# Altium project SurfaceControlSystem_RevA.PrjPcb
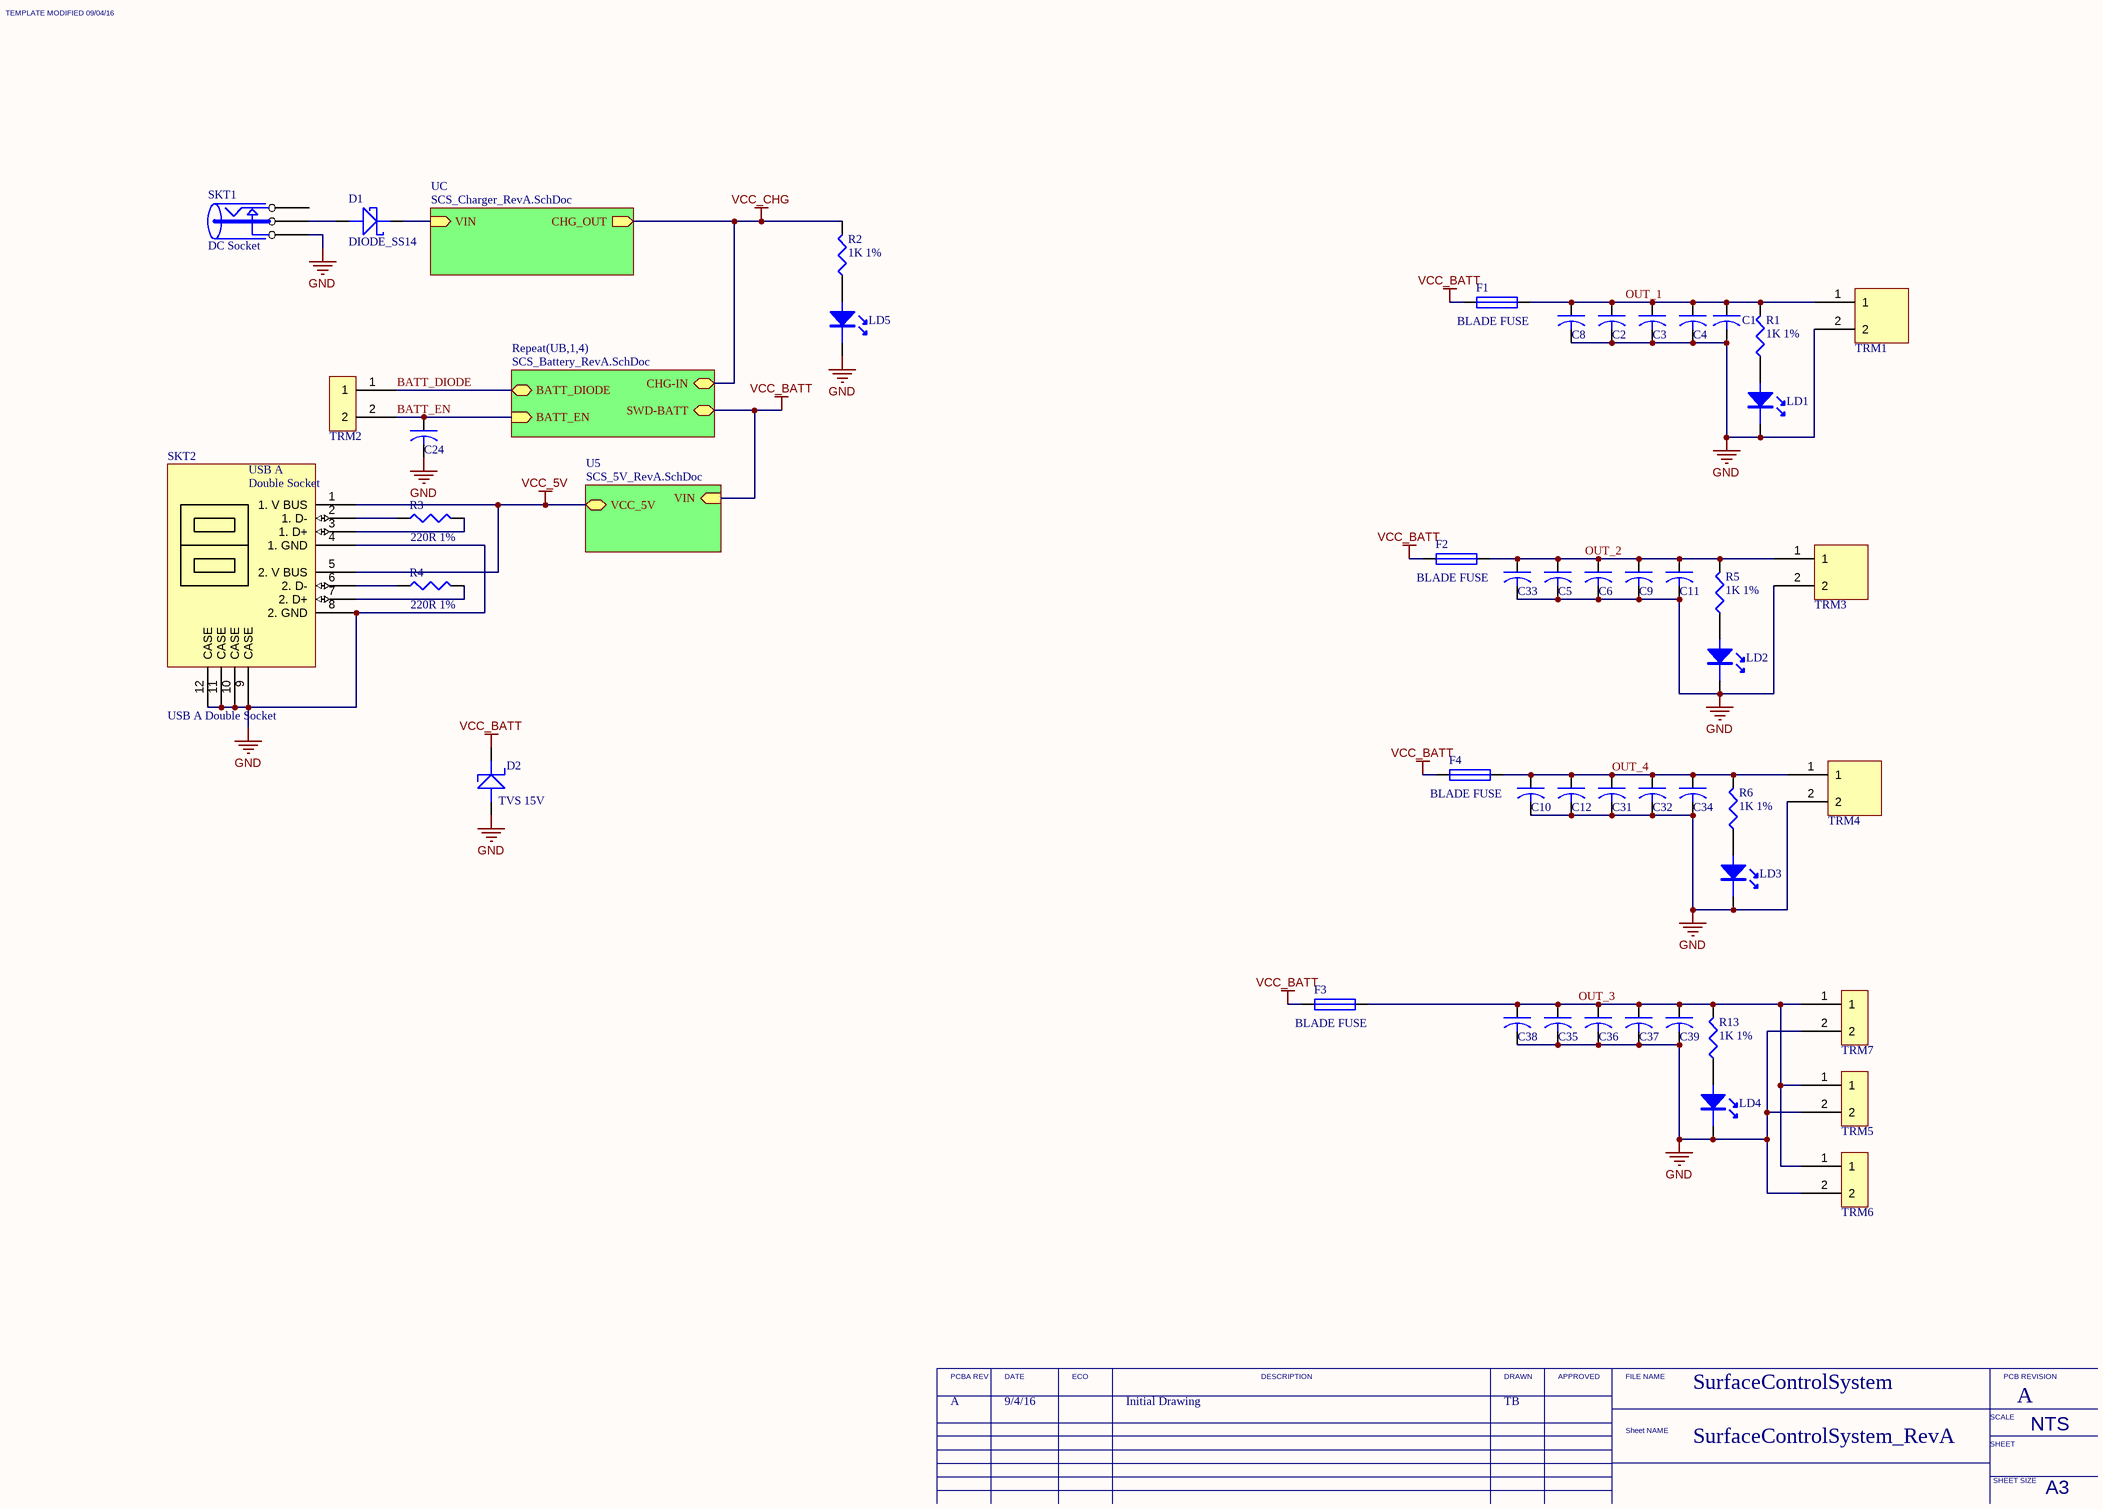
[diagram p0: SurfaceControlSystem_RevA.SchDoc]
4 sheets, 136 parts. Net scope: hierarchical (ports join the sheet entries above them; power ports are global).
Board file: SurfaceControlSystem.PcbDoc
Sheets:
  SurfaceControlSystem_RevA.SchDoc
    UB1 = SCS_Battery_RevA.SchDoc
    UB2 = SCS_Battery_RevA.SchDoc
    UB3 = SCS_Battery_RevA.SchDoc
    UB4 = SCS_Battery_RevA.SchDoc
    U5 = SCS_5V_RevA.SchDoc
    UC = SCS_Charger_RevA.SchDoc

## Sheet SurfaceControlSystem_RevA.SchDoc
size A3; _PRJ_TITLE: PROJECT TITLE; _SHT_TITLE: Sheet; _REV: A; PageSetup: Record=PageOptions|CenterHorizontal=True|CenterVertical=True|PrintScale=0.71|XCorrection=1.00|YCorrection=1.00|PrintKind=0|BorderSize=5000000|LeftOffset=0|BottomOffset=0|Orientation=2|PaperLength=1000|PaperWidth=1000|Scale=100|PaperSource=258|PrintQuality=600|MediaType=1|DitherType=10|PaperKind=A3 (297x420mm)|PrintScaleMode=1

### Parts
C1  10UF 25V  [1206]  (value not drawn)
C2  10UF 25V  [1206]  (value not drawn)
C3  10UF 25V  [1206]  (value not drawn)
C4  10UF 25V  [1206]  (value not drawn)
C5  10UF 25V  [1206]  (value not drawn)
C6  10UF 25V  [1206]  (value not drawn)
C8  100nF 50V  [0603]  (value not drawn)
C9  10UF 25V  [1206]  (value not drawn)
C10  100nF 50V  [0603]  (value not drawn)
C11  10UF 25V  [1206]  (value not drawn)
C12  10UF 25V  [1206]  (value not drawn)
C24  100nF 50V  [0603]  (value not drawn)
C31  10UF 25V  [1206]  (value not drawn)
C32  10UF 25V  [1206]  (value not drawn)
C33  100nF 50V  [0603]  (value not drawn)
C34  10UF 25V  [1206]  (value not drawn)
C35  10UF 25V  [1206]  (value not drawn)
C36  10UF 25V  [1206]  (value not drawn)
C37  10UF 25V  [1206]  (value not drawn)
C38  100nF 50V  [0603]  (value not drawn)
C39  10UF 25V  [1206]  (value not drawn)
D1  DIODE_SS14  [DO-214AC]
D2  TVS 15V  [DO-214AB]
F1  BLADE FUSE  [FUSEHOLDER_BLADE]
F2  BLADE FUSE  [FUSEHOLDER_BLADE]
F3  BLADE FUSE  [FUSEHOLDER_BLADE]
F4  BLADE FUSE  [FUSEHOLDER_BLADE]
LD1  Green LED 0805  [0805DIODE]  (value not drawn)
LD2  Green LED 0805  [0805DIODE]  (value not drawn)
LD3  Green LED 0805  [0805DIODE]  (value not drawn)
LD4  Green LED 0805  [0805DIODE]  (value not drawn)
LD5  Green LED 0805  [0805DIODE]  (value not drawn)
R1  1K 1%  [0603]
R2  1K 1%  [0603]
R3  220R 1%  [0603]
R4  220R 1%  [0603]
R5  1K 1%  [0603]
R6  1K 1%  [0603]
R13  1K 1%  [0603]
SKT1  DC Socket  [SKT_PWR]
SKT2  USB A Double Socket  [USB_A_DoubleSocket]
TRM1  2way screw terminal, High current  [TERM_2POS_HORIZ_7.62MM]  (value not drawn)
TRM2  Wurth 2way screw terminal  [TERM_2POS_HORIZ_5.08MM]  (value not drawn)
TRM3  2way screw terminal, High current  [TERM_2POS_HORIZ_7.62MM]  (value not drawn)
TRM4  2way screw terminal, High current  [TERM_2POS_HORIZ_7.62MM]  (value not drawn)
TRM5  Wurth 2way screw terminal  [TERM_2POS_HORIZ_5.08MM]  (value not drawn)
TRM6  Wurth 2way screw terminal  [TERM_2POS_HORIZ_5.08MM]  (value not drawn)
TRM7  Wurth 2way screw terminal  [TERM_2POS_HORIZ_5.08MM]  (value not drawn)

### Sub-sheets
Repeat(UB,1,4) = SCS_Battery_RevA.SchDoc: SWD-BATT (bidir), CHG-IN (bidir), BATT_EN (in), BATT_DIODE (bidir)
U5 = SCS_5V_RevA.SchDoc: VIN (in), VCC_5V (bidir)
UC = SCS_Charger_RevA.SchDoc: VIN (in), CHG_OUT (out)

### Nets
GND: C1.2 C2.2 C3.2 C4.2 C5.2 C6.2 C8.2 C9.2 C10.2 C11.2 C12.2 C24.2 C31.2 C32.2 C33.2 C34.2 C35.2 C36.2 C37.2 C38.2 C39.2 D2.A LD1.K LD2.K LD3.K LD4.K LD5.K SKT1.SW SKT2.4(1._GND) SKT2.8(2._GND) SKT2.9(CASE) SKT2.10(CASE) SKT2.11(CASE) SKT2.12(CASE) TRM1.2 TRM3.2 TRM4.2 TRM5.2 TRM6.2 TRM7.2
VCC_5V: SKT2.1(1._V_BUS) SKT2.5(2._V_BUS) ; sheet U5/VCC_5V  [project net 5v]
VCC_BATT: D2.K F1.1 F2.1 F3.1 F4.1 ; sheet Repeat(UB,1,4)/SWD-BATT, sheet U5/VIN
VCC_CHG: R2.2 ; sheet Repeat(UB,1,4)/CHG-IN, sheet UC/CHG_OUT
BATT_DIODE: TRM2.1 ; sheet Repeat(UB,1,4)/BATT_DIODE
BATT_EN: C24.1 TRM2.2 ; sheet Repeat(UB,1,4)/BATT_EN
Chg_In: D1.K ; sheet UC/VIN
OUT_1: C1.1 C2.1 C3.1 C4.1 C8.1 F1.2 R1.2 TRM1.1
OUT_2: C5.1 C6.1 C9.1 C11.1 C33.1 F2.2 R5.2 TRM3.1
OUT_3: C35.1 C36.1 C37.1 C38.1 C39.1 F3.2 R13.2 TRM5.1 TRM6.1 TRM7.1
OUT_4: C10.1 C12.1 C31.1 C32.1 C34.1 F4.2 R6.2 TRM4.1
NetD1_A: D1.A SKT1.PIN
NetLD1_A: LD1.A R1.1
NetLD2_A: LD2.A R5.1
NetLD3_A: LD3.A R6.1
NetLD4_A: LD4.A R13.1
NetLD5_A: LD5.A R2.1
NetR3_1: R3.1 SKT2.3(1._D+)
NetR3_2: R3.2 SKT2.2(1._D-)
NetR4_1: R4.1 SKT2.7(2._D+)
NetR4_2: R4.2 SKT2.6(2._D-)

Not connected (* = marked no-connect by the designer): SKT1 COM

### Notes on the sheet
- SurfaceControlSystem
- A
- 9/4/16
- Initial Drawing
- TB
- SurfaceControlSystem_RevA
- TEMPLATE MODIFIED 09/04/16
- PCBA REV
- DATE
- ECO
- DESCRIPTION
- DRAWN
- APPROVED
- FILE NAME
- PCB REVISION
- Sheet NAME
- SCALE
- SHEET
- NTS
- SHEET SIZE
- A3
- (in symbol USB_A_Double) USB A; Double Socket

### Library data of the parts
C1-C6 C9 C11 C12 C31 C32 C34-C37 C39 = CAP_10UF_25V_10%_1206: CAP CER 10UF 25V 10% X5R 1206; Manufacturer: Murata; Manufacturer P/N: GRM319R61E106KA12D
C8 C10 C24 C33 C38 = CAP_100NF_50V_10%_0603: CAP CER 100nF 50V 10% X7R 0603; Manufacturer: Murata; Manufacturer P/N: GRM188R71H104KA93D
D1 = DIODE_SS14: Schottky Diode, 1A, 40V SS14; Manufacturer: Fairchild; Manufacturer P/N: SS14
D2 = DIODE_TVS_SMCJ15A: TVS Diode, 15V; Manufacturer: LIttlefuse; Manufacturer P/N: SMCJ15A
F1-F4 = FUSE_BLADE_500V_30A_PCB: FUSE CLIP BLADE 500V 30A PCB; Manufacturer: Keystone Electronics; Manufacturer P/N: 3522-2
LD1-LD5 = LED_Green_0805: WL-SMCW SMD CHIP LED WATERCLEAR; Manufacturer: Wurth; Manufacturer P/N: 150080VS75000
R1 R2 R5 R6 R13 = RES_1K_1%_0603: Resistor, 1K, 1%, 0603; Manufacturer: Bourns Inc; Manufacturer P/N: CR0603-FX-1001ELF
R3 R4 = RES_220R_1%_0603: Resistor, 220R, 1%, 0603; Manufacturer: Bourns Inc; Manufacturer P/N: CR0603-FX-2200ELF
SKT1 = SOCKET_DC: Manufacturer: N/A; Manufacturer P/N: N/A
SKT2 = USB_A_Double: PartNo: P1301; Supplier: Altronics
TRM1 TRM3 TRM4 = TRM_2way_ScrewTerminal_7.62mm: TERM BLOCK 2POS HORIZ 7.62MM T/H; Manufacturer: Altronics; Manufacturer P/N: P4343
TRM2 TRM5-TRM7 = TRM_2way_ScrewTerminal: TERM BLOCK 2POS HORIZ 5.08MM T/H; Manufacturer: Wurth Electronics Inc; Manufacturer P/N: 691216510002

## Sheet SCS_Battery_RevA.SchDoc
size A3; _PRJ_TITLE: PROJECT TITLE; _SHT_TITLE: Sheet; _REV: A; PageSetup: Record=PageOptions|CenterHorizontal=True|CenterVertical=True|PrintScale=0.71|XCorrection=1.00|YCorrection=1.00|PrintKind=0|BorderSize=5000000|LeftOffset=0|BottomOffset=0|Orientation=2|PaperLength=1000|PaperWidth=1000|Scale=100|PaperSource=258|PrintQuality=600|MediaType=1|DitherType=10|PaperKind=A3 (297x420mm)|PrintScaleMode=1
Used 4 times, as channels UB1, UB2, UB3, UB4. Parts and nets are listed once, with the designators drawn on the sheet.
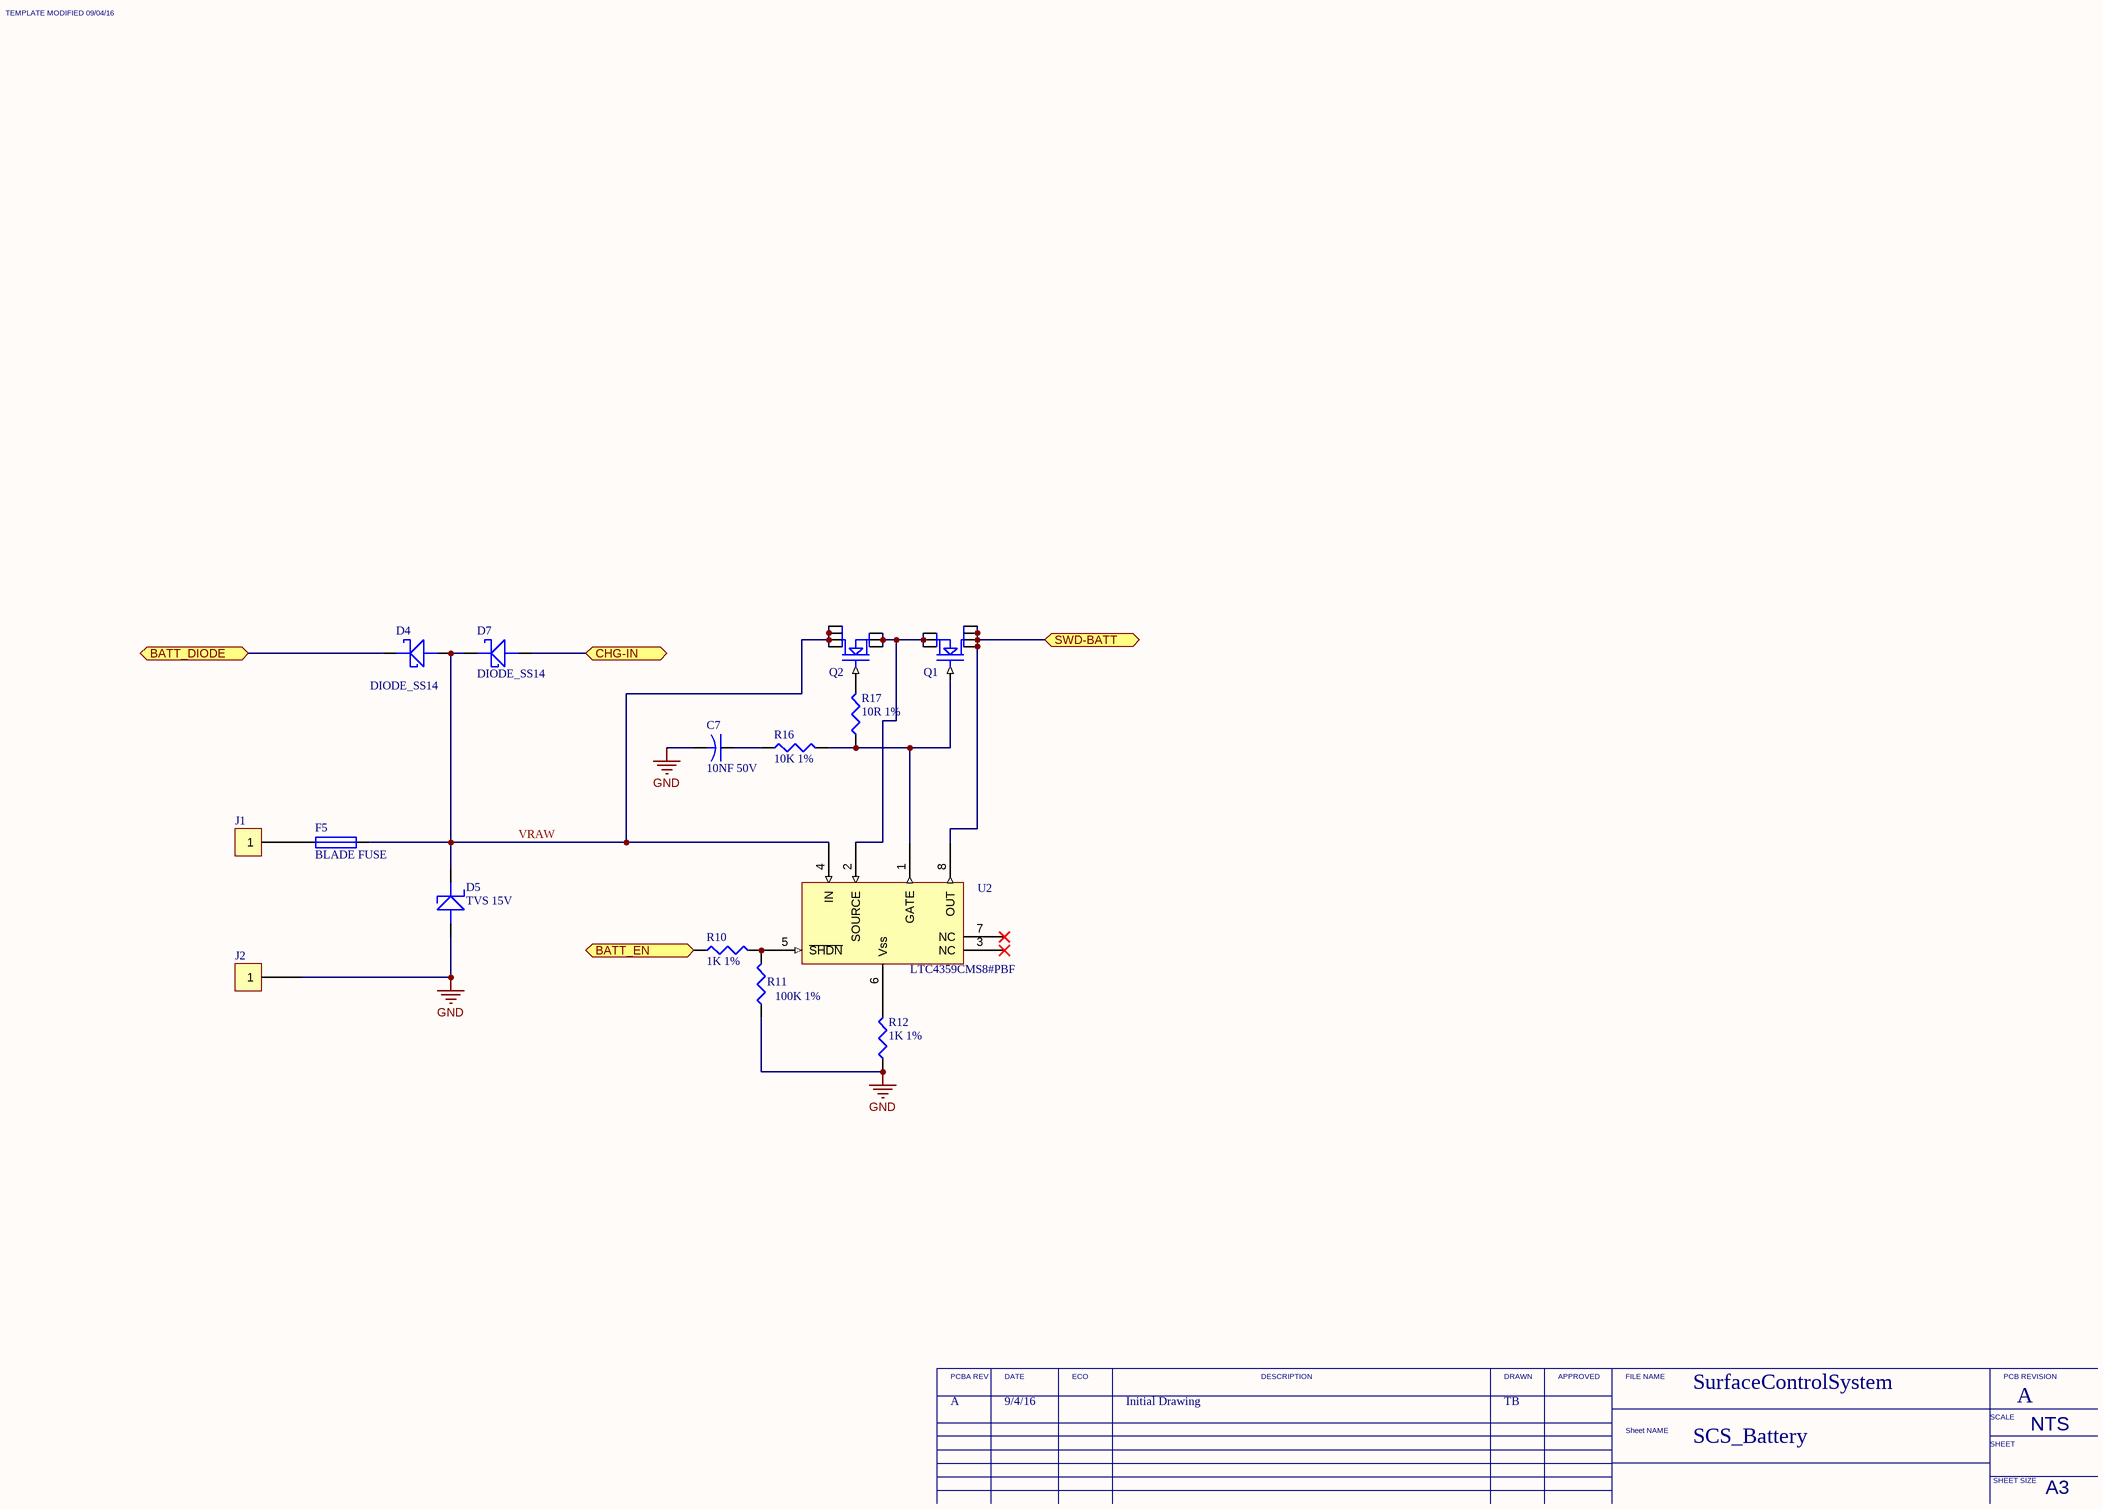
[diagram p1: SCS_Battery_RevA.SchDoc]

### Parts
C7  10NF 50V  [0603]
D4  DIODE_SS14  [DO-214AC]
D5  TVS 15V  [DO-214AB]
D7  DIODE_SS14  [DO-214AC]
F5  BLADE FUSE  [FUSEHOLDER_BLADE]
J1  5mm Pitch 6.3mm SPADE  [CON_5mm_6.3MM_SPADE]  (value not drawn)
J2  5mm Pitch 6.3mm SPADE  [CON_5mm_6.3MM_SPADE]  (value not drawn)
Q1  N Channel FET  [SO-8]  (value not drawn)
Q2  N Channel FET  [SO-8]  (value not drawn)
R10  1K 1%  [0603]
R11  100K 1%  [0603]
R12  1K 1%  [0603]
R16  10K 1%  [0603]
R17  10R 1%  [0603]
U2  LTC4359CMS8#PBF  [TSOP65P490X110-8M]

### Ports
BATT_DIODE (bidir), BATT_EN (in), CHG-IN (bidir), SWD-BATT (bidir)

### Nets
GND: C7.2 D5.A J2.1 R11.1 R12.1
BATT_DIODE: D4.K ; port BATT_DIODE
BATT_EN: R10.1 ; port BATT_EN
CHG-IN: D7.A ; port CHG-IN
SWD-BATT: Q1.5(DRAIN) Q1.6(DRAIN) Q1.7(DRAIN) Q1.8(DRAIN) U2.8(OUT) ; port SWD-BATT
VRAW: D4.A D5.K D7.K F5.2 Q2.5(DRAIN) Q2.6(DRAIN) Q2.7(DRAIN) Q2.8(DRAIN) U2.4(IN)
NetC7_1: C7.1 R16.1
NetF5_1: F5.1 J1.1
NetQ1_1: Q1.1(SOURCE) Q1.2(SOURCE) Q1.3(SOURCE) Q2.1(SOURCE) Q2.2(SOURCE) Q2.3(SOURCE) U2.2(SOURCE)
NetQ1_4: Q1.4(GATE) R16.2 R17.1 U2.1(GATE)
NetQ2_4: Q2.4(GATE) R17.2
NetR10_2: R10.2 R11.2 U2.5(~{SHDN})
NetR12_2: R12.2 U2.6(Vss)

Not connected (* = marked no-connect by the designer): U2 3(NC)* 7(NC)*

### Channels
UB1: designators end in _UB1; ports BATT_DIODE=BATT_DIODE BATT_EN=BATT_EN CHG-IN=VCC_CHG SWD-BATT=VCC_BATT
UB2: designators end in _UB2; ports BATT_DIODE=BATT_DIODE BATT_EN=BATT_EN CHG-IN=VCC_CHG SWD-BATT=VCC_BATT
UB3: designators end in _UB3; ports BATT_DIODE=BATT_DIODE BATT_EN=BATT_EN CHG-IN=VCC_CHG SWD-BATT=VCC_BATT
UB4: designators end in _UB4; ports BATT_DIODE=BATT_DIODE BATT_EN=BATT_EN CHG-IN=VCC_CHG SWD-BATT=VCC_BATT

### Notes on the sheet
- SurfaceControlSystem
- A
- 9/4/16
- Initial Drawing
- TB
- SCS_Battery
- TEMPLATE MODIFIED 09/04/16
- PCBA REV
- DATE
- ECO
- DESCRIPTION
- DRAWN
- APPROVED
- FILE NAME
- PCB REVISION
- Sheet NAME
- SCALE
- SHEET
- NTS
- SHEET SIZE
- A3

### Library data of the parts
C7 = CAP_10NF_50V_10%_0603: CAP CER 10NF 50V 10% X7R 0603; Manufacturer: Murata; Manufacturer P/N: GRM188R71H103KA01D
D4 D7 = DIODE_SS14: as D1 on sheet SurfaceControlSystem_RevA; Manufacturer P/N: SS14
D5 = DIODE_TVS_SMCJ15A: TVS Diode, 15V; Manufacturer: LIttlefuse; Manufacturer P/N: SMCJ15A
F5 = FUSE_BLADE_500V_30A_PCB: as F1 on sheet SurfaceControlSystem_RevA
J1 J2 = CON_5mm_6.3MM_SPADE: Manufacturer: Dinkle; Manufacturer P/N: P-850
Q1 Q2 = Q_AO4578: MOSFET N-CH 30V 20A LFPAK; Manufacturer: Alpha & Omega Semiconductor Inc.; Manufacturer P/N: AO4578
R10 R12 = RES_1K_1%_0603: as R1 on sheet SurfaceControlSystem_RevA
R11 = RES_100K_1%_0603: Resistor, 100K, 1%, 0603; Manufacturer: Bourns Inc; Manufacturer P/N: CRT0603-BY-1003ELF
R16 = RES_10K_1%_0603: Resistor, 10K, 1%, 0603; Manufacturer: Bourns Inc; Manufacturer P/N: CR0603-FX-1002HLF
R17 = RES_10R_1%_0603: Resistor, 10R, 1%, 0603; Manufacturer: Bourns Inc; Manufacturer P/N: CR0603-FX-10R0ELF
U2 = IC_LTC4359: Ideal Diode Controller; Manufacturer: Linear Technology; Manufacturer P/N: LTC4359CMS8#PBF

## Sheet SCS_5V_RevA.SchDoc
size A3; _PRJ_TITLE: PROJECT TITLE; _SHT_TITLE: Sheet; _REV: A; PageSetup: Record=PageOptions|CenterHorizontal=True|CenterVertical=True|PrintScale=0.71|XCorrection=1.00|YCorrection=1.00|PrintKind=0|BorderSize=5000000|LeftOffset=0|BottomOffset=0|Orientation=2|PaperLength=1000|PaperWidth=1000|Scale=100|PaperSource=258|PrintQuality=600|MediaType=1|DitherType=10|PaperKind=A3 (297x420mm)|PrintScaleMode=1
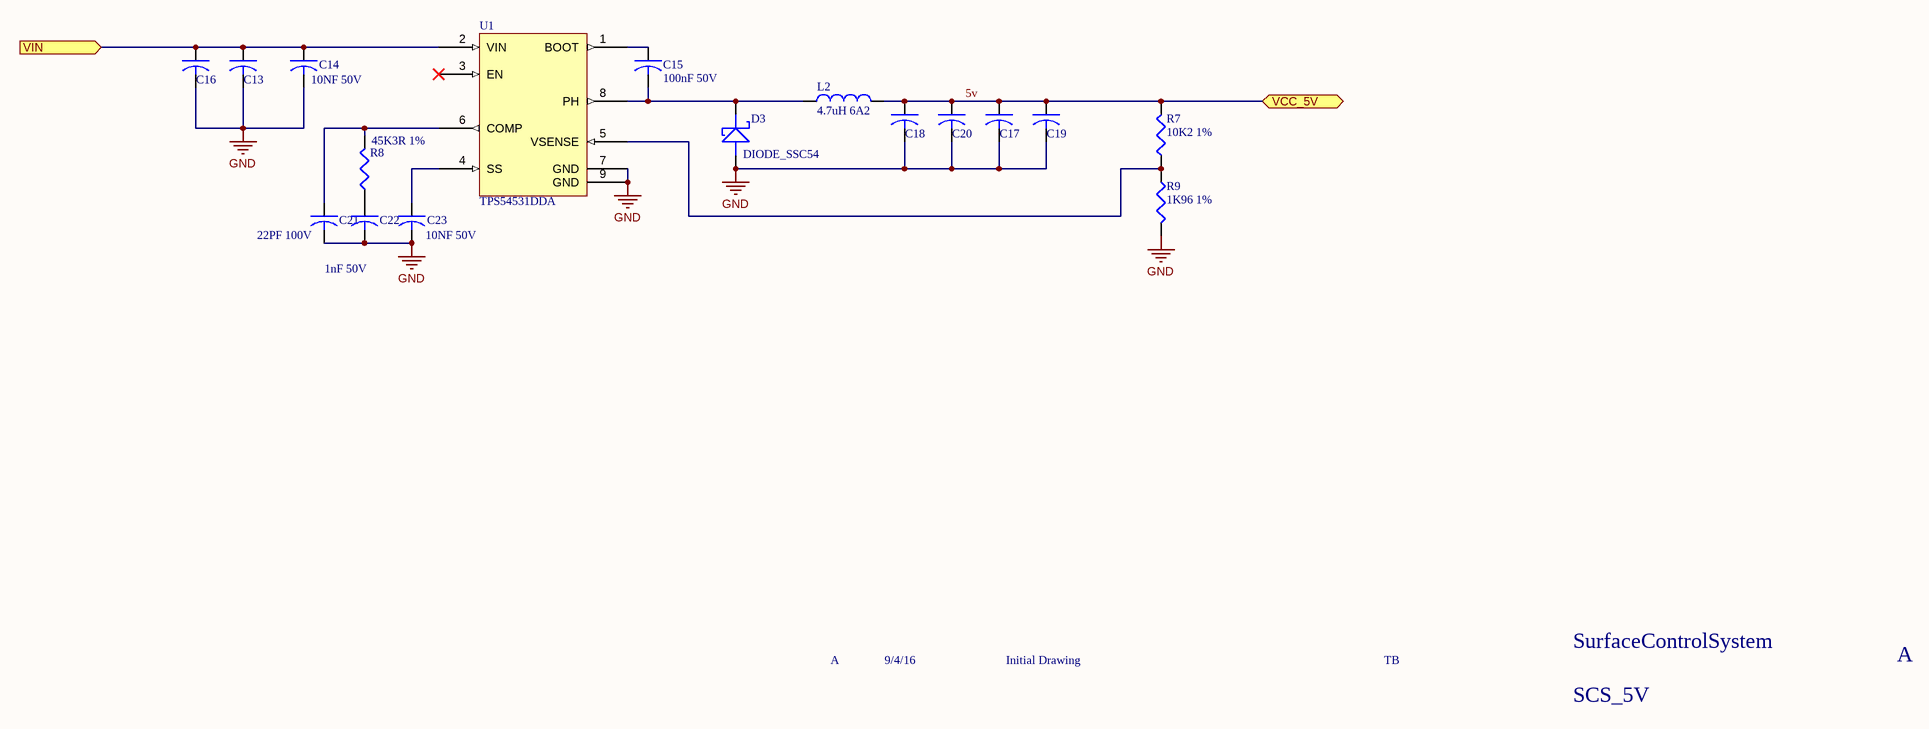
[diagram p2: SCS_5V_RevA.SchDoc]

### Parts
C13  10UF 25V  [1206]  (value not drawn)
C14  10NF 50V  [0603]
C15  100nF 50V  [0603]
C16  10UF 25V  [1206]  (value not drawn)
C17  10UF 25V  [1206]  (value not drawn)
C18  10UF 25V  [1206]  (value not drawn)
C19  10UF 25V  [1206]  (value not drawn)
C20  10UF 25V  [1206]  (value not drawn)
C21  22PF 100V  [0603]
C22  1nF 50V  [0603]
C23  10NF 50V  [0603]
D3  DIODE_SSC54  [DO-214AB]
L2  4.7uH 6A2  [Wurth744771156]
R7  10K2 1%  [0603]
R8  45K3R 1%  [0603]
R9  1K96 1%  [0603]
U1  TPS54531DDA  [PSOP-8]

### Ports
VCC_5V (bidir), VIN (in)

### Nets
5v: C17.1 C18.1 C19.1 C20.1 L2.2 R7.2 ; port VCC_5V
GND: C13.2 C14.2 C16.2 C17.2 C18.2 C19.2 C20.2 C21.2 C22.2 C23.2 D3.A R9.2 U1.7(GND) U1.9(GND)
VCC_BATT: C13.1 C14.1 C16.1 U1.2(VIN) ; port VIN
NetC15_1: C15.1 U1.1(BOOT)
NetC15_2: C15.2 D3.K L2.1 U1.8(PH)
NetC21_1: C21.1 R8.2 U1.6(COMP)
NetC22_1: C22.1 R8.1
NetC23_1: C23.1 U1.4(SS)
NetR7_1: R7.1 R9.1 U1.5(VSENSE)

Not connected (* = marked no-connect by the designer): U1 3(EN)*

### Notes on the sheet
- SurfaceControlSystem
- A
- 9/4/16
- Initial Drawing
- TB
- SCS_5V
- TEMPLATE MODIFIED 09/04/16
- PCBA REV
- DATE
- ECO
- DESCRIPTION
- DRAWN
- APPROVED
- FILE NAME
- PCB REVISION
- Sheet NAME
- SCALE
- SHEET
- NTS
- SHEET SIZE
- A3

### Library data of the parts
C13 C16-C20 = CAP_10UF_25V_10%_1206: as C1 on sheet SurfaceControlSystem_RevA
C14 C23 = CAP_10NF_50V_10%_0603: as C7 on sheet SCS_Battery_RevA
C15 = CAP_100NF_50V_10%_0603: as C8 on sheet SurfaceControlSystem_RevA
C21 = CAP_22PF_100V_5%_0603: CAP CER 22PF 100V 5% NP0 0603; Manufacturer: Murata; Manufacturer P/N: GRM1885C2A220JA01D
C22 = CAP_1NF_50V_10%_0603: CAP CER 1nF 50V 10% X7R 0603; Manufacturer: Murata; Manufacturer P/N: GRM188R71H102KA01D
D3 = DIODE_SSC54: Schottky Diode, 5A, 40V SSC54, DO214AB; Manufacturer: Vishay; Manufacturer P/N: SSC54-E3/9AT
L2 = IND_4.7uH_6A2: FIXED IND 4.7UH 6.2A 34 MOHM; Manufacturer: Wurth Electronics Inc; Manufacturer P/N: 74437356047
R7 = RES_10K2_1%_0603: Resistor, 10K2, 1%, 0603; Manufacturer: Yageo; Manufacturer P/N: RC0603FR-0710K2L
R8 = RES_45K3_1%_0603: Resistor, 45K3, 1%, 0603; Manufacturer: Bourns Inc; Manufacturer P/N: CR0603-FX-4532ELF
R9 = RES_1K96_1%_0603: Resistor, 1K96, 1%, 0603; Manufacturer: Yageo; Manufacturer P/N: RC0603FR-071K96L
U1 = IC_SMPS_TPS54531: SMPS; Manufacturer: TI; Manufacturer P/N: TPS54531DDA

## Sheet SCS_Charger_RevA.SchDoc
size A3; _PRJ_TITLE: PROJECT TITLE; _SHT_TITLE: Sheet; _REV: A; PageSetup: Record=PageOptions|CenterHorizontal=True|CenterVertical=True|PrintScale=0.71|XCorrection=1.00|YCorrection=1.00|PrintKind=0|BorderSize=5000000|LeftOffset=0|BottomOffset=0|Orientation=2|PaperLength=1000|PaperWidth=1000|Scale=100|PaperSource=258|PrintQuality=600|MediaType=1|DitherType=10|PaperKind=A3 (297x420mm)|PrintScaleMode=1
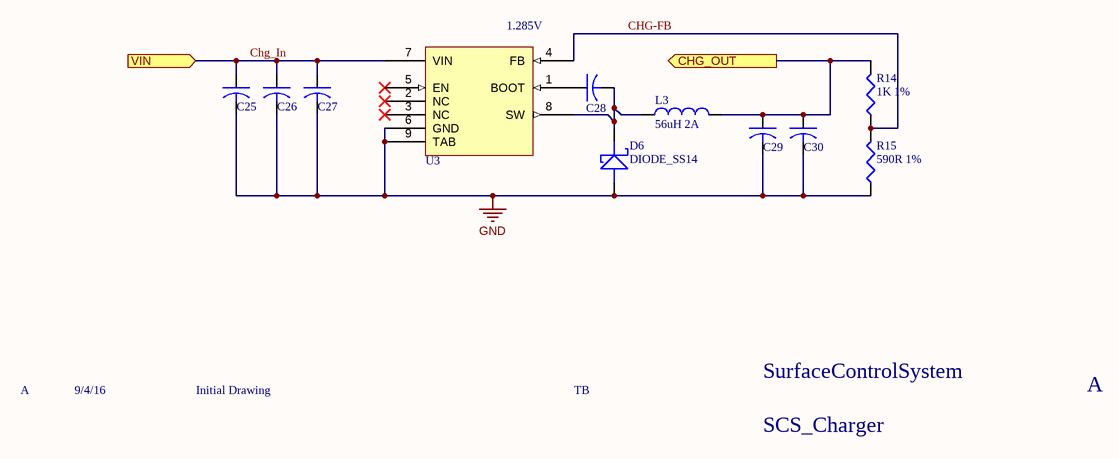
[diagram p3: SCS_Charger_RevA.SchDoc]

### Parts
C25  10UF 25V  [1206]  (value not drawn)
C26  10UF 25V  [1206]  (value not drawn)
C27  100nF 50V  [0603]  (value not drawn)
C28  10NF 50V  [0603]  (value not drawn)
C29  10UF 25V  [1206]  (value not drawn)
C30  10UF 25V  [1206]  (value not drawn)
D6  DIODE_SS14  [DO-214AC]
L3  56uH 2A  [Wurth744771156]
R14  1K 1%  [0603]
R15  590R 1%  [0603]
U3  Buck Reg  [PSOP-8]  (value not drawn)

### Ports
CHG_OUT (out), VIN (in)

### Nets
GND: C25.2 C26.2 C27.2 C29.2 C30.2 D6.A R15.1 U3.6(GND) U3.9(TAB)
VCC_CHG: C29.1 C30.1 L3.2 R14.2 ; port CHG_OUT
CHG-FB: R14.1 R15.2 U3.4(FB)
Chg_In: C25.1 C26.1 C27.1 U3.7(VIN) ; port VIN
NetC28_1: C28.1 U3.1(BOOT)
NetC28_2: C28.2 D6.K L3.1 U3.8(SW)

Not connected (* = marked no-connect by the designer): U3 2(NC)* 3(NC)* 5(EN)*

### Notes on the sheet
- (near U3) 1.285V
- SurfaceControlSystem
- A
- 9/4/16
- Initial Drawing
- TB
- SCS_Charger
- TEMPLATE MODIFIED 09/04/16
- PCBA REV
- DATE
- ECO
- DESCRIPTION
- DRAWN
- APPROVED
- FILE NAME
- PCB REVISION
- Sheet NAME
- SCALE
- SHEET
- NTS
- SHEET SIZE
- A3

### Library data of the parts
C25 C26 C29 C30 = CAP_10UF_25V_10%_1206: as C1 on sheet SurfaceControlSystem_RevA
C27 = CAP_100NF_50V_10%_0603: as C8 on sheet SurfaceControlSystem_RevA
C28 = CAP_10NF_50V_10%_0603: as C7 on sheet SCS_Battery_RevA
D6 = DIODE_SS14: as D1 on sheet SurfaceControlSystem_RevA; Manufacturer P/N: SS14
L3 = IND_56uH_2.01A: FIXED IND 56UH 2.01A 110 MOHM; Manufacturer: Wurth Electronics Inc; Manufacturer P/N: 744771156
R14 = RES_1K_1%_0603: as R1 on sheet SurfaceControlSystem_RevA
R15 = RES_590R_1%_0603: Resistor, 590R, 1%, 0603; Manufacturer: Bourns Inc; Manufacturer P/N: CR0603-FX-5900ELF
U3 = IC_REG_LM22675: IC REG BUCK 5V 1A 8SOPWRPAD; Manufacturer: Texas Instruments; Manufacturer P/N: LM22675MRE-5.0/NOPB

## Nets that join several sheets
5v: SurfaceControlSystem_RevA (SKT2.1 SKT2.5), SCS_5V_RevA (6 pins)
GND: SurfaceControlSystem_RevA (40 pins), UB1 (5 pins), UB2 (5 pins), UB3 (5 pins), UB4 (5 pins), SCS_5V_RevA (14 pins), SCS_Charger_RevA (9 pins)
VCC_BATT: SurfaceControlSystem_RevA (5 pins), UB1 (5 pins), UB2 (5 pins), UB3 (5 pins), UB4 (5 pins), SCS_5V_RevA (C13.1 C14.1 C16.1 U1.2)
VCC_CHG: SurfaceControlSystem_RevA (R2.2), UB1 (D7_UB1.A), UB2 (D7_UB2.A), UB3 (D7_UB3.A), UB4 (D7_UB4.A), SCS_Charger_RevA (C29.1 C30.1 L3.2 R14.2)
BATT_DIODE: SurfaceControlSystem_RevA (TRM2.1), UB1 (D4_UB1.K), UB2 (D4_UB2.K), UB3 (D4_UB3.K), UB4 (D4_UB4.K)
BATT_EN: SurfaceControlSystem_RevA (C24.1 TRM2.2), UB1 (R10_UB1.1), UB2 (R10_UB2.1), UB3 (R10_UB3.1), UB4 (R10_UB4.1)
Chg_In: SurfaceControlSystem_RevA (D1.K), SCS_Charger_RevA (C25.1 C26.1 C27.1 U3.7)